# EAGLE design ESP-03_Breakout (EAGLE 7.4.0)
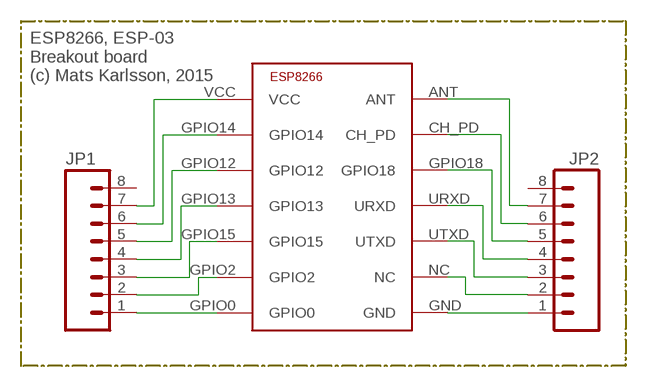
[diagram p0: schematic, sheet 1]

## Parts
JP1  M08SMD-STRAIGHT-FEMALE  [1X08_SMD]
JP2  M08SMD-STRAIGHT-FEMALE  [1X08_SMD]
U$1  ESP8266-03  [ESP-03]

## Nets
ANT: JP2.7 U$1.ANT
CH_PD: JP2.6 U$1.CH_PD
GND: JP2.1 U$1.GND
GPIO0: JP1.1 U$1.GPIO0
GPIO2: JP1.2 U$1.GPIO2
GPIO12: JP1.5 U$1.GPIO12
GPIO13: JP1.4 U$1.GPIO13
GPIO14: JP1.6 U$1.GPIO14
GPIO15: JP1.3 U$1.GPIO15
GPIO18: JP2.5 U$1.GPIO18
NC: JP2.2 U$1.NC
RXD: JP2.4 U$1.URXD
TXD: JP2.3 U$1.UTXD
VCC: JP1.7 U$1.VCC
Unconnected: JP1.8 JP2.8

## Notes on the sheet
- ESP8266, ESP-03
  Breakout board
  (c) Mats Karlsson, 2015

## Library data of the parts
JP1 JP2 = SparkFun-Connectors:M08: Header 8 Standard 8-pin 0.1" header. Use with straight break away headers (SKU : PRT-00116), right angle break away headers (PRT-00553), swiss pins (PRT-00743), machine pins (PRT-00117), and female headers (PRT-00115).; PROD_ID: CONN-10204
U$1 = #ESP8266:ESP8266-03: ESP8266 - ESP-03 Module

## Board
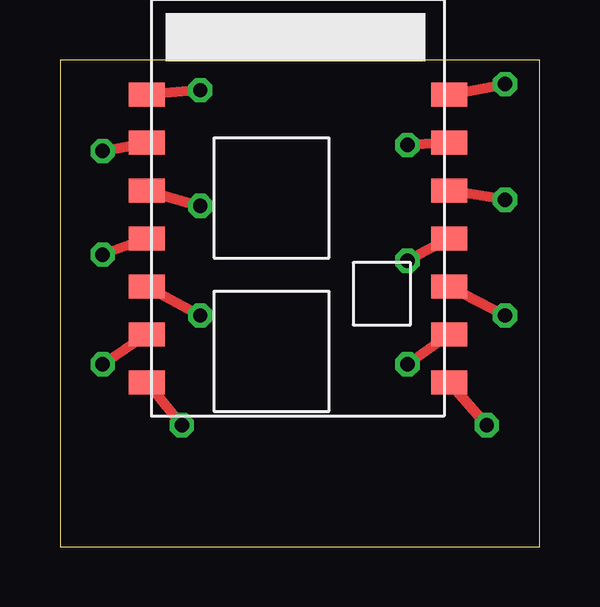
[diagram p1: board, top side]
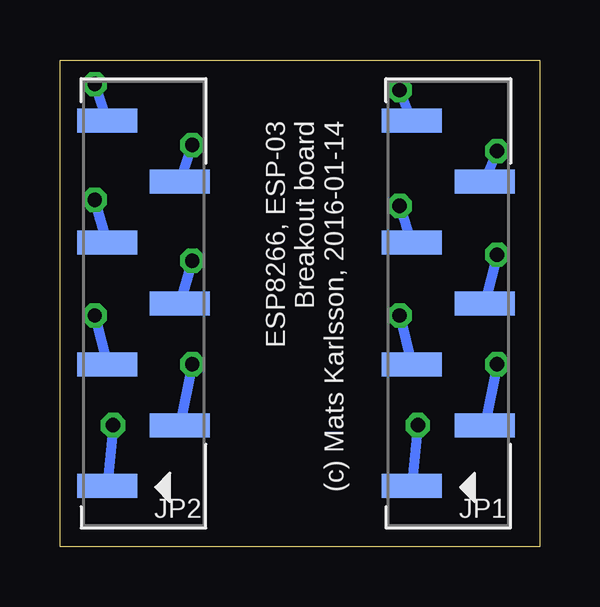
[diagram p2: board, bottom side, seen from below]

Size 19.99 x 20.31 mm. Coordinates in mm from the lower left corner, seen from the top.
Outline: 0,0 19.99,0 19.99,20.31 0,20.31 0,0
Copper layers (1*16): Top 0.035mm / dielectric 1.5mm / Bottom 0.035mm
Design rules "default": minimum track width 10mil, minimum drill 24mil, track to track 8mil, track to pad 8mil, pad to pad 8mil, via to via 8mil, smd to smd 8mil, copper to edge 40mil, drill to drill 8mil, minimum pad ring 10mil, minimum via ring 8mil, stop-mask expansion 4mil, vias tented up to drill 0mil, thermal gap 10mil

### Footprints (pad centres in the part's own frame; a part is rotated, then mirrored left to right if it is on the bottom)
1X07_SMT = smd 1 x 2.5: 1 -7.62,1.52; 2 -5.08,-1.52; 3 -2.54,1.52; 4 0,-1.52; 5 2.54,1.52; 6 5.08,-1.52; 7 7.62,1.52
ESP-03 = smd 1 x 1.5: ANT 4,12.4; CH_PD 6,12.4; GND 16,12.4; GPIO0 16,-0.2; GPIO2 14,-0.2; GPIO12 8,-0.2; GPIO13 10,-0.2; GPIO14 6,-0.2; GPIO15 12,-0.2; GPIO18 8,12.4; NC 14,12.4; URXD 10,12.4; UTXD 12,12.4; VCC 4,-0.2

### Placement (x,y rotation side)
JP1  [1X07_SMT]  3.81,10.16 90 bottom
JP2  [1X07_SMT]  16.51,10.16 90 bottom
U$1  3.81,22.86 270 top

### Tracks (layer width: path | path; a pad name or v marks a point on that pad's centre or on a via)
ANT  (via drill 0.6)
  Top 0.406: U$1.ANT v18.54,19.3
  Bottom 0.406: v18.54,19.3 JP2.7
CH_PD  (via drill 0.6)
  Top 0.406: U$1.CH_PD v14.48,16.76
  Bottom 0.406: v14.48,16.76 JP2.6
GND  (via drill 0.6)
  Top 0.406: U$1.GND v17.78,5.08
  Bottom 0.406: v17.78,5.08 JP2.1
GPIO0  (via drill 0.6)
  Top 0.406: U$1.GPIO0 v5.08,5.08
  Bottom 0.406: v5.08,5.08 JP1.1
GPIO2  (via drill 0.6)
  Top 0.406: U$1.GPIO2 v1.78,7.62
  Bottom 0.406: v1.78,7.62 JP1.2
GPIO12  (via drill 0.6)
  Top 0.406: U$1.GPIO12 v5.84,14.22
  Bottom 0.406: v5.84,14.22 JP1.5
GPIO13  (via drill 0.6)
  Top 0.406: U$1.GPIO13 v1.78,12.19
  Bottom 0.406: v1.78,12.19 JP1.4
GPIO14  (via drill 0.6)
  Top 0.406: v1.78,16.51 U$1.GPIO14
  Bottom 0.406: JP1.6 v1.78,16.51
GPIO15  (via drill 0.6)
  Top 0.406: U$1.GPIO15 v5.84,9.65
  Bottom 0.406: v5.84,9.65 JP1.3
GPIO18  (via drill 0.6)
  Top 0.406: v18.54,14.48 U$1.GPIO18
  Bottom 0.406: JP2.5 v18.54,14.48
NC  (via drill 0.6)
  Top 0.406: U$1.NC v14.48,7.62
  Bottom 0.406: v14.48,7.62 JP2.2
RXD  (via drill 0.6)
  Top 0.406: U$1.URXD v14.48,11.94
  Bottom 0.406: v14.48,11.94 JP2.4
TXD  (via drill 0.6)
  Top 0.406: U$1.UTXD v18.54,9.65
  Bottom 0.406: v18.54,9.65 JP2.3
VCC  (via drill 0.6)
  Top 0.406: v5.84,19.05 U$1.VCC
  Bottom 0.406: JP1.7 v5.84,19.05

### Text on the board
bNames: ESP8266, ESP-03 / Breakout board / (c) Mats Karlsson, 2016-01-14